# Altium schematic sheet Sheet1.SchDoc
size A4
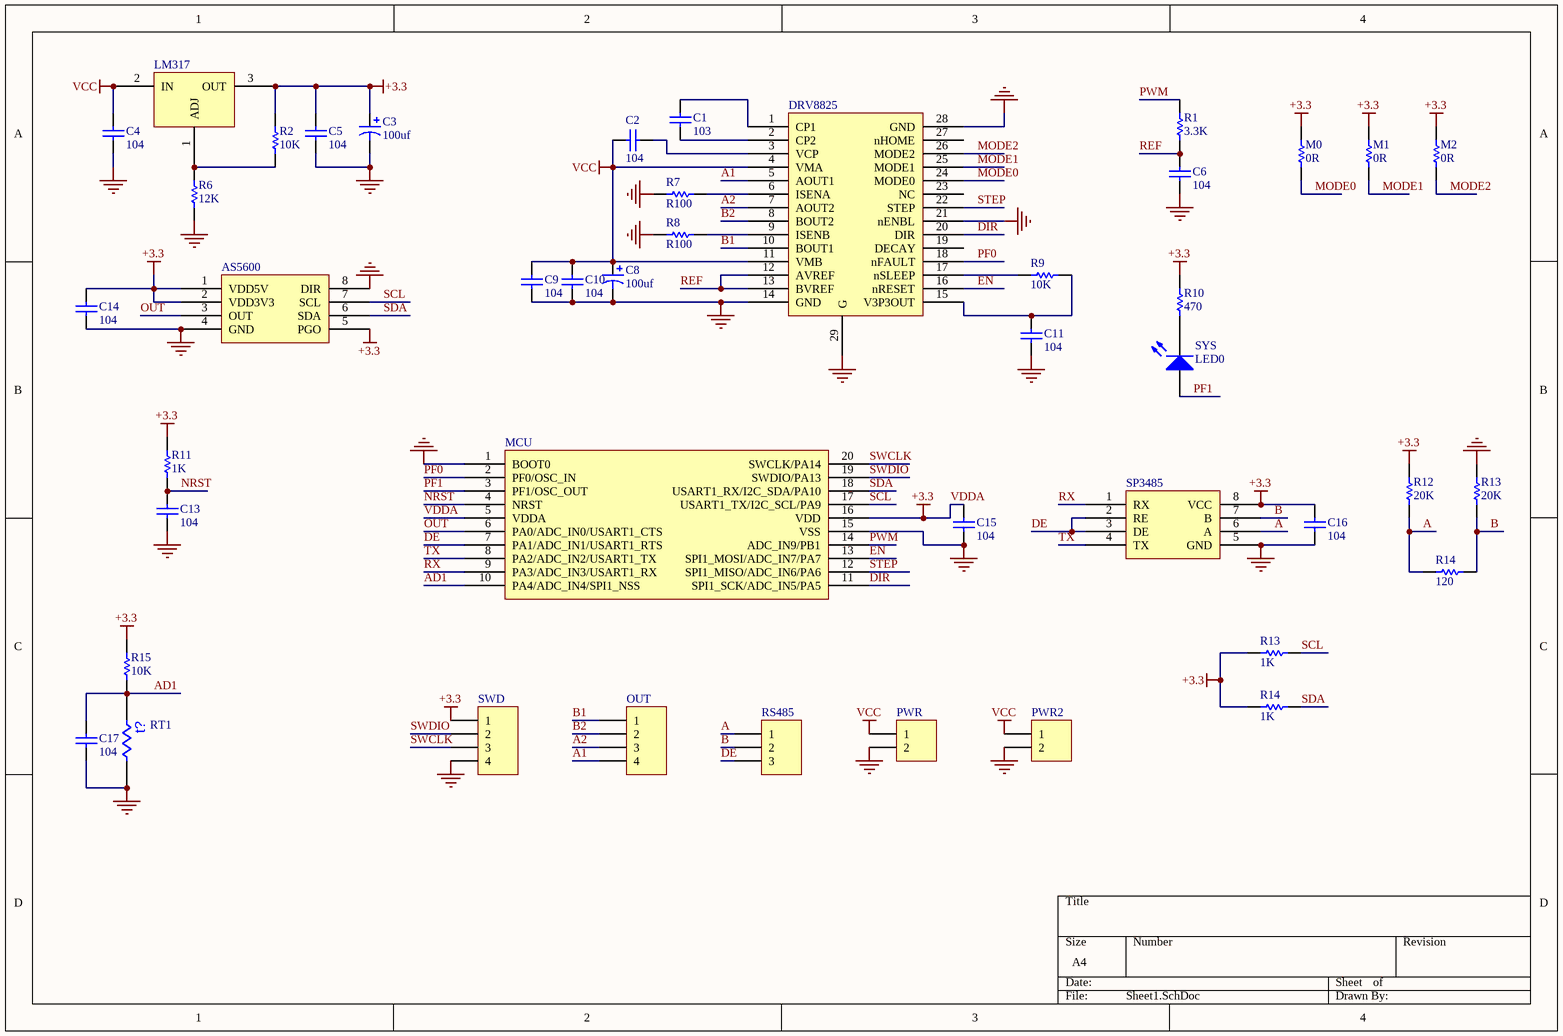
[diagram p0: Sheet1.SchDoc]

## Parts
(Parts that share a designator on the sheet are numbered #1, #2 ... from top to bottom, then left to right.)
AS5600  AS5600  [SOIC-8]  (value not drawn)
C1  value 103  [0603]  (hidden comment: Cap)
C2  value 104  [0603]  (hidden comment: Cap)
C3  value 100uf  [1206]  (hidden comment: Cap Pol1)
C4  value 104  [0603]  (hidden comment: Cap)
C5  value 104  [0603]  (hidden comment: Cap)
C6  value 104  [0603]  (hidden comment: Cap)
C8  value 100uf  [CAP2]  (hidden comment: Cap Pol1)
C9  value 104  [0603]  (hidden comment: Cap)
C10  value 104  [0603]  (hidden comment: Cap)
C11  value 104  [0603]  (hidden comment: Cap)
C13  value 104  [0603]  (hidden comment: Cap)
C14  value 104  [0603]  (hidden comment: Cap)
C15  value 104  [0603]  (hidden comment: Cap)
C16  value 104  [0603]  (hidden comment: Cap)
C17  value 104  [0603]  (hidden comment: Cap)
DRV8825  DRV8825  [HTSSOP28]  (value not drawn)
LM317  LM317  [TO252-3]  (value not drawn)
M0  value 0R  [0402]  (hidden comment: Res1)
M1  value 0R  [0402]  (hidden comment: Res1)
M2  value 0R  [0402]  (hidden comment: Res1)
MCU  STM32F030F4P6  [TSSOP-20]  (value not drawn)
OUT  Header 4  [HDR1X4]  (value not drawn)
PWR  Header 2  [HDR1X2]  (value not drawn)
PWR2  Header 2  [HDR1X2]  (value not drawn)
R1  value 3.3K  [0603]  (hidden comment: Res1)
R2  value 10K  [0603]  (hidden comment: Res1)
R6  value 12K  [0603]  (hidden comment: Res1)
R7  value R100  [0805]  (hidden comment: Res1)
R8  value R100  [0805]  (hidden comment: Res1)
R9  value 10K  [0603]  (hidden comment: Res1)
R10  value 470  [0603]  (hidden comment: Res1)
R11  value 1K  [0603]  (hidden comment: Res1)
R12  value 20K  [0603]  (hidden comment: Res1)
R13#1  value 20K  [0603]  (hidden comment: Res1)
R13#2  value 1K  [0603]  (hidden comment: Res1)
R14#1  value 120  [0805]  (hidden comment: Res1)
R14#2  value 1K  [0603]  (hidden comment: Res1)
R15  value 10K  [0603]  (hidden comment: Res1)
RS485  Header 3  [HDR1X3]  (value not drawn)
RT1  Res Thermal  [HDR1X2]  (value not drawn)
SP3485  SP3485  [SOIC-8]  (value not drawn)
SWD  Header 4  [HDR1X4]  (value not drawn)
SYS  LED0  [0603]

## Nets
GND: AS5600.4(GND) AS5600.8(DIR) C3.2 C4.1 C5.1 C6.1 C8.2 C9.1 C10.1 C11.1 C13.1 C14.1 C15.2 C16.1 C17.1 DRV8825.14(GND) DRV8825.21(nENBL) DRV8825.28(GND) DRV8825.29(G) MCU.1(BOOT0) MCU.15(VSS) PWR.2 PWR2.2 R6.1 R7.2 R8.2 R13#1.1 RT1.2 SP3485.5(GND) SWD.4
VCC: C2.1 C4.2 C8.1 C9.2 C10.2 DRV8825.4(VMA) DRV8825.11(VMB) LM317.2(IN) PWR.1 PWR2.1
VDDA: AS5600.1(VDD5V) AS5600.2(VDD3V3) AS5600.5(PGO) C3.1 C5.2 C14.2 C15.1 C16.2 LM317.3(OUT) M0.1 M1.1 M2.1 MCU.5(VDDA) MCU.16(VDD) R2.1 R10.1 R11.1 R12.1 R13#2.1 R14#2.1 R15.1 SP3485.8(VCC) SWD.1  [also labelled +3.3]
A: R12.2 R14#1.1 RS485.1 SP3485.6(A)
A1: DRV8825.5(AOUT1) OUT.4
A2: DRV8825.7(AOUT2) OUT.3
AD1: C17.2 MCU.10(PA4/ADC_IN4/SPI1_NSS) R15.2 RT1.1
B: R13#1.2 R14#1.2 RS485.2 SP3485.7(B)
B1: DRV8825.10(BOUT1) OUT.1
B2: DRV8825.8(BOUT2) OUT.2
DE: MCU.7(PA1/ADC_IN1/USART1_RTS) RS485.3 SP3485.2(RE) SP3485.3(DE)
DIR: DRV8825.20(DIR) MCU.11(SPI1_SCK/ADC_IN5/PA5)
EN: DRV8825.16(nRESET) MCU.13(SPI1_MOSI/ADC_IN7/PA7)
MODE0: DRV8825.24(MODE0) M0.2
MODE1: DRV8825.25(MODE1) M1.2
MODE2: DRV8825.26(MODE2) M2.2
NRST: C13.2 MCU.4(NRST) R11.2
OUT: AS5600.3(OUT) MCU.6(PA0/ADC_IN0/USART1_CTS)
PF0: DRV8825.18(nFAULT) MCU.2(PF0/OSC_IN)
PF1: MCU.3(PF1/OSC_OUT) SYS.1(A)
PWM: MCU.14(ADC_IN9/PB1) R1.1
REF: C6.2 DRV8825.12(AVREF) DRV8825.13(BVREF) R1.2
RX: MCU.9(PA3/ADC_IN3/USART1_RX) SP3485.1(RX)
SCL: AS5600.7(SCL) MCU.17(USART1_TX/I2C_SCL/PA9) R13#2.2
SDA: AS5600.6(SDA) MCU.18(USART1_RX/I2C_SDA/PA10) R14#2.2
STEP: DRV8825.22(STEP) MCU.12(SPI1_MISO/ADC_IN6/PA6)
SWCLK: MCU.20(SWCLK/PA14) SWD.3
SWDIO: MCU.19(SWDIO/PA13) SWD.2
TX: MCU.8(PA2/ADC_IN2/USART1_TX) SP3485.4(TX)
NetC1_1: C1.1 DRV8825.1(CP1)
NetC1_2: C1.2 DRV8825.2(CP2)
NetC2_2: C2.2 DRV8825.3(VCP)
NetC11_2: C11.2 DRV8825.15(V3P3OUT) R9.2
NetDRV8825_6: DRV8825.6(ISENA) R7.1
NetDRV8825_9: DRV8825.9(ISENB) R8.1
NetDRV8825_17: DRV8825.17(nSLEEP) R9.1
NetLM317_1: LM317.1(ADJ) R2.2 R6.2
NetR10_2: R10.2 SYS.2(K)

Not connected (* = marked no-connect by the designer): DRV8825 19(DECAY) 23(NC) 27(nHOME)

## Notes on the sheet
- (in symbol Res Thermal) t?

## Library data of the parts
C1 C2 C4-C6 C9-C11 C13-C17 = Cap: Capacitor; Published: 8-Jun-2000; LatestRevisionDate: 17-Jul-2002; LatestRevisionNote: Re-released for DXP Platform.; PackageReference: RAD-0.3; Publisher: Altium Limited; PackageDescription: Radial Cap, Thru-Hole; 2 Leads; 0.3 in Pin Spacing
C3 C8 = Cap Pol1: Polarized Capacitor (Radial); Published: 8-Jun-2000; LatestRevisionDate: 17-Jul-2002; LatestRevisionNote: Re-released for DXP Platform.; PackageReference: RB7.6-15; Publisher: Altium Limited; PackageDescription: Polarized Capacitor (Radial); 2 Leads
LM317 = LM317: pin to pad: 2>3 3>2
M0-M2 R1 R2 R6-R12 R13#1 R13#2 R14#1 R14#2 R15 = Res1: Resistor; Published: 8-Jun-2000; LatestRevisionDate: 17-Jul-2002; LatestRevisionNote: Re-released for DXP Platform.; PackageReference: AXIAL-0.3; Publisher: Altium Limited; PackageDescription: Axial Device, Thru-Hole; 2 Leads; 0.3 in Pin Spacing
OUT SWD = Header 4: Header, 4-Pin; LatestRevisionDate: 17-Jul-2002; LatestRevisionNote: Re-released for DXP Platform.; Publisher: Altium Limited
PWR PWR2 = Header 2: Header, 2-Pin; LatestRevisionDate: 17-Jul-2002; LatestRevisionNote: Re-released for DXP Platform.; Publisher: Altium Limited
RS485 = Header 3: Header, 3-Pin; LatestRevisionDate: 17-Jul-2002; LatestRevisionNote: Re-released for DXP Platform.; Publisher: Altium Limited
RT1 = Res Thermal: Thermistor; Published: 24-Mar-1999; LatestRevisionDate: 29-May-2009; LatestRevisionNote: IPC-7351 Footprint Added.; PackageVersion: Mar-2003; PackageReference: 6-0805; Publisher: Altium Limited; PackageDescription: Chip Resistor 0805 Case Size; Code_IPC: RESC2012
SYS = LED0: Typical INFRARED GaAs LED; Published: 8-Jun-2000; LatestRevisionDate: 08-Jul-2005; LatestRevisionNote: Mech Layer 1 removed.; PackageReference: LED-0; Publisher: Altium Limited; PackageDescription: LED; 2 Leads